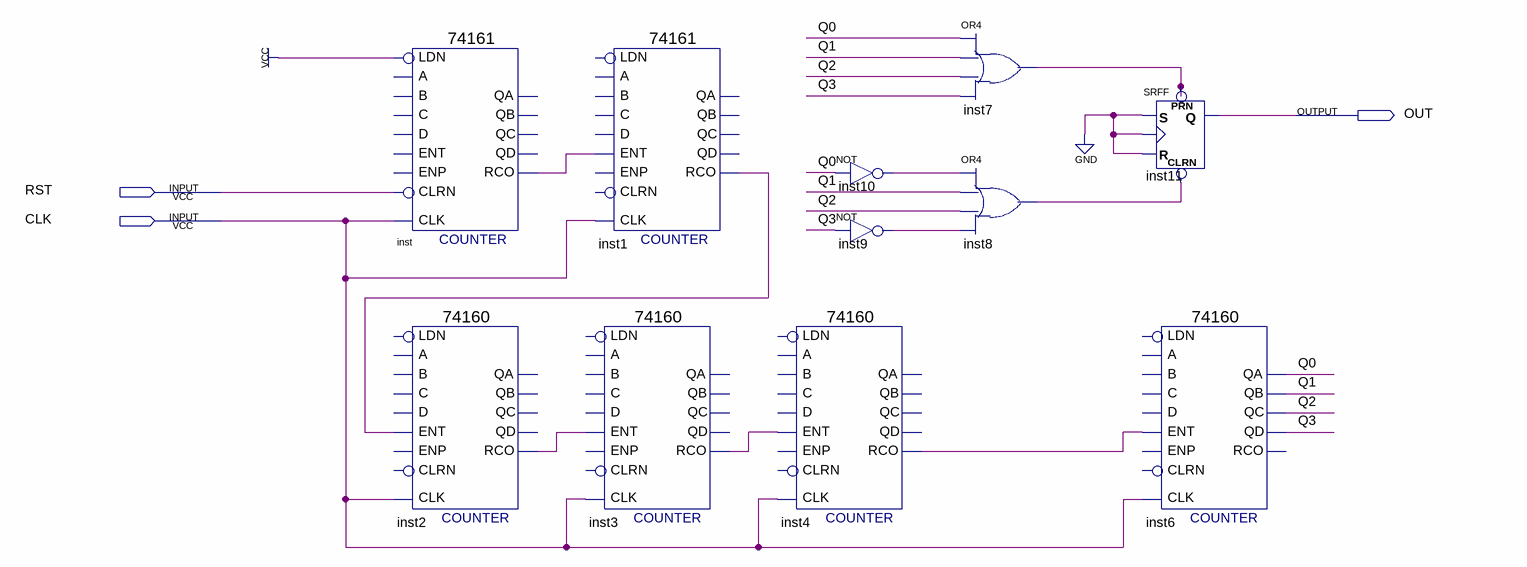
[diagram p0: schematic sheet]
// Quartus schematic temporizador_decimo_segundo.bdf as structural Verilog: 11 symbols, 3 pins
module temporizador_decimo_segundo (
  input  RST,
  input  CLK,
  output OUT
);

  wire inst1_rco, inst2_rco, inst3_rco, inst4_rco, inst7_out, inst8_out, inst9_out, inst10_out, inst_rco, Q0,
       Q1, Q2, Q3;

  \74161  inst (.CLRN(RST), .CLK(CLK), .LDN(1'b1), .RCO(inst_rco));  // open: ENP, A, D, ENT, B, C, QD, QC, QB, QA
  \74160  inst2 (.CLK(CLK), .ENT(inst1_rco), .RCO(inst2_rco));  // open: A, B, C, D, LDN, ENP, CLRN, QD, QA, QB, QC
  \74161  inst1 (.CLK(CLK), .ENT(inst_rco), .RCO(inst1_rco));  // open: CLRN, ENP, LDN, A, D, B, C, QD, QC, QB, QA
  \74160  inst3 (.CLK(CLK), .ENT(inst2_rco), .RCO(inst3_rco));  // open: A, B, C, D, LDN, ENP, CLRN, QD, QA, QB, QC
  not inst10 (inst10_out, Q0);
  not inst9 (inst9_out, Q3);
  \74160  inst4 (.CLK(CLK), .ENT(inst3_rco), .RCO(inst4_rco));  // open: A, B, C, D, LDN, ENP, CLRN, QD, QA, QB, QC
  or inst7 (inst7_out, Q0, Q1, Q2, Q3);
  or inst8 (inst8_out, inst10_out, Q1, Q2, inst9_out);
  SRFF inst11 (.PRN(inst7_out), .CLRN(inst8_out), .S(1'b0), .R(1'b0), .CLK(1'b0), .Q(OUT));
  \74160  inst6 (
    .CLK(CLK), .ENT(inst4_rco), .QD(Q3), .QA(Q0), .QB(Q1), .QC(Q2));  // open: A, B, C, D, LDN, ENP, CLRN, RCO
endmodule
